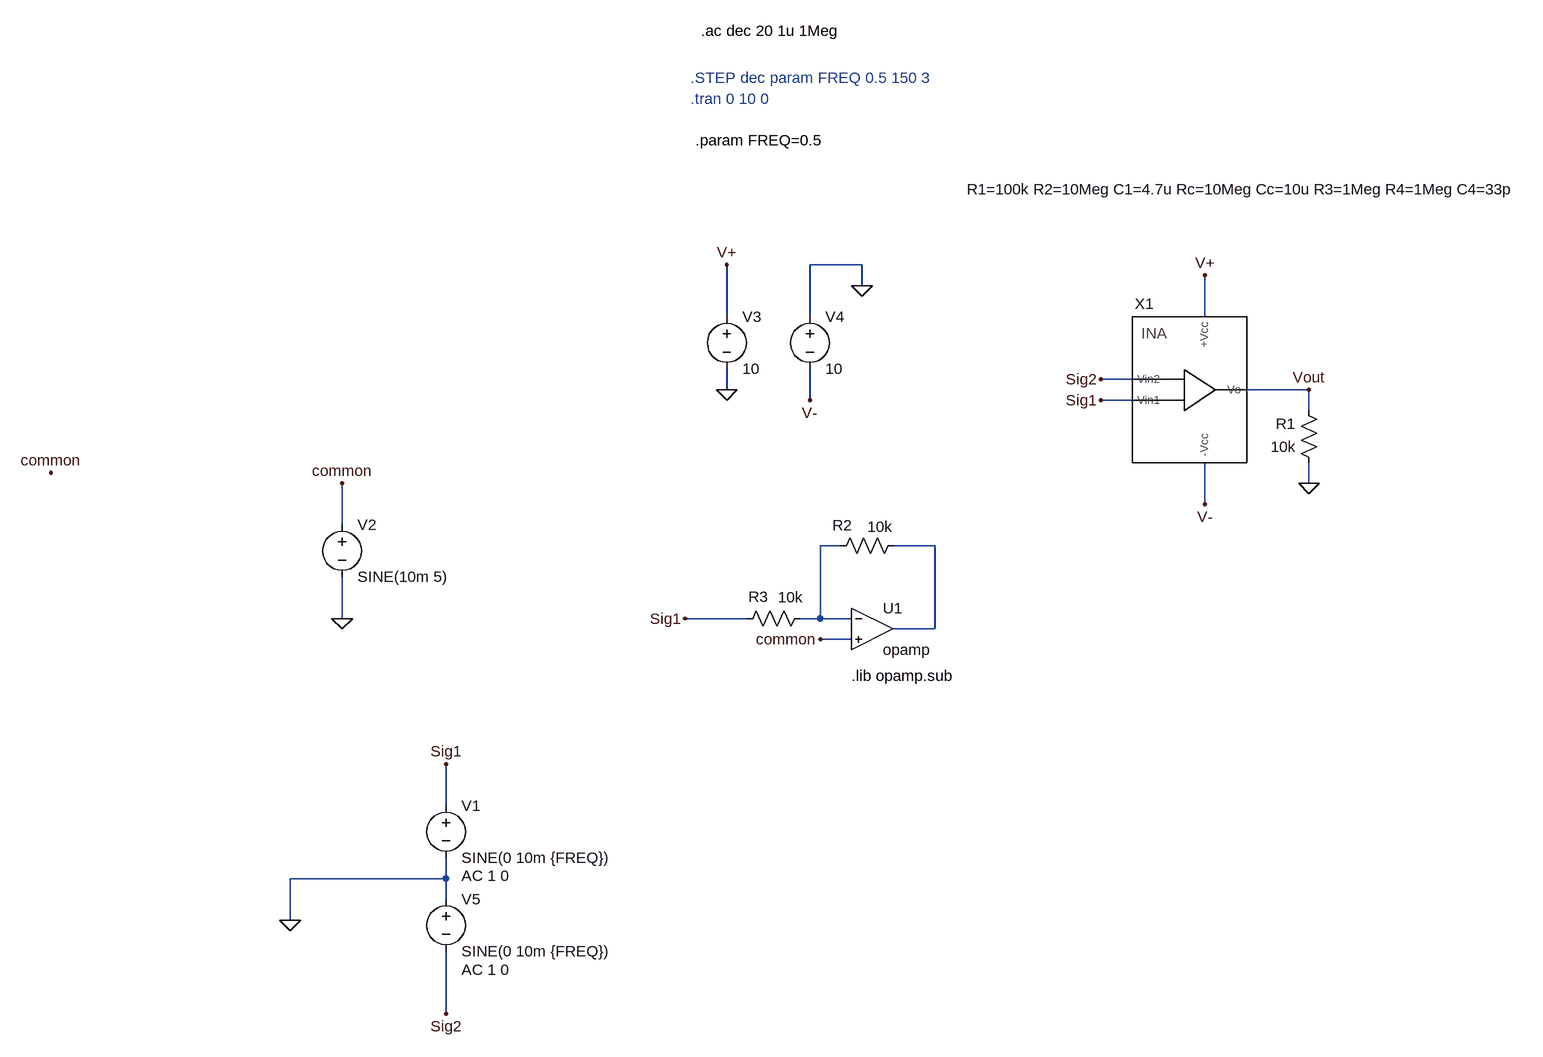
[diagram p0: schematic Test.asc]
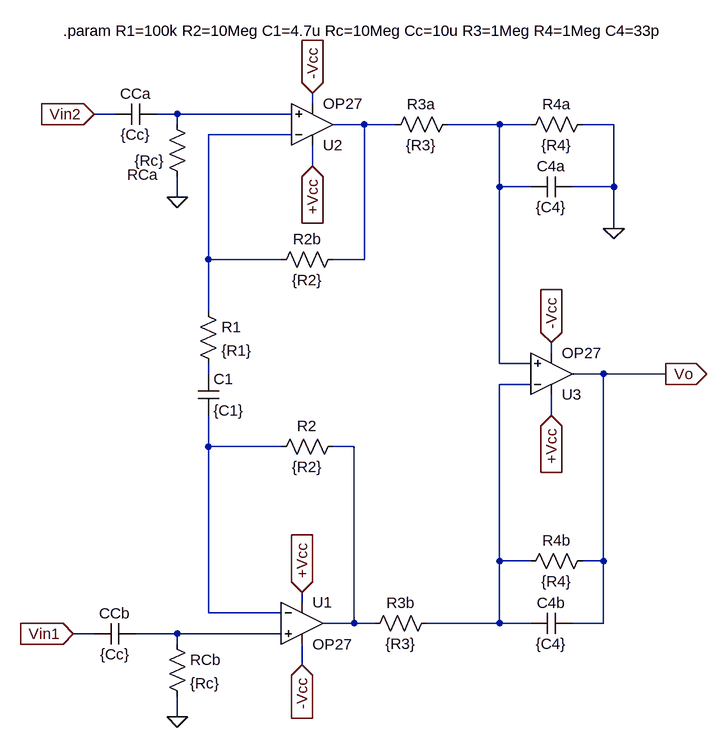
[diagram p1: sub-circuit instrument.asc]
Test.asc, the LTspice schematic file:
Version 4.1
SHEET 1 972 1232
WIRE -240 -16 -320 -16
WIRE -240 16 -240 -16
WIRE -448 64 -448 -16
WIRE -320 64 -320 -16
WIRE 288 64 288 0
WIRE 176 160 128 160
WIRE -448 176 -448 144
WIRE 448 176 352 176
WIRE -320 192 -320 144
WIRE 176 192 128 192
WIRE 448 208 448 176
WIRE 448 320 448 288
WIRE 288 352 288 288
WIRE -1040 384 -1040 320
WIRE -272 416 -304 416
WIRE -128 416 -192 416
WIRE -1040 528 -1040 464
WIRE -416 528 -512 528
WIRE -304 528 -304 416
WIRE -304 528 -336 528
WIRE -256 528 -304 528
WIRE -128 544 -128 416
WIRE -128 544 -192 544
WIRE -256 560 -304 560
WIRE -880 816 -880 752
WIRE -880 928 -880 896
WIRE -880 928 -1120 928
WIRE -880 960 -880 928
WIRE -1120 992 -1120 928
WIRE -880 1136 -880 1040
FLAG -880 1136 Sig2
FLAG -304 560 common
FLAG -512 528 Sig1
FLAG 128 192 Sig1
FLAG 128 160 Sig2
FLAG -1040 528 0
FLAG -1040 320 common
FLAG -1488 304 common
FLAG -880 752 Sig1
FLAG 448 320 0
FLAG 448 176 Vout
FLAG 288 352 V-
FLAG 288 0 V+
FLAG -1120 992 0
FLAG -240 16 0
FLAG -448 176 0
FLAG -448 -16 V+
FLAG -320 192 V-
SYMBOL Instrument 288 176 R0
WINDOW 39 61 -293 Bottom 2
SYMATTR SpiceLine R1=100k R2=10Meg C1=4.7u Rc=10Meg Cc=10u R3=1Meg R4=1Meg C4=33p
SYMATTR InstName X1
SYMBOL lib\\lib\\sym\\opamp -224 480 R0
SYMATTR InstName U1
SYMBOL res -176 400 R90
WINDOW 0 0 94 VBottom 2
WINDOW 3 -29 36 VTop 2
SYMATTR InstName R2
SYMATTR Value 10k
SYMBOL res -320 512 R90
WINDOW 0 -2 79 VBottom 2
WINDOW 3 -32 30 VTop 2
SYMATTR InstName R3
SYMATTR Value 10k
SYMBOL voltage -880 800 R0
WINDOW 123 24 124 Left 2
WINDOW 39 0 0 Left 0
SYMATTR Value2 AC 1 0
SYMATTR InstName V1
SYMATTR Value SINE(0 10m {FREQ})
SYMBOL voltage -1040 368 R0
WINDOW 123 0 0 Left 0
WINDOW 39 0 0 Left 0
SYMATTR InstName V2
SYMATTR Value SINE(10m 5)
SYMBOL res 464 304 R180
WINDOW 0 36 76 Left 2
WINDOW 3 36 40 Left 2
SYMATTR InstName R1
SYMATTR Value 10k
SYMBOL voltage -448 48 R0
WINDOW 123 0 0 Left 0
WINDOW 39 0 0 Left 0
SYMATTR InstName V3
SYMATTR Value 10
SYMBOL voltage -320 48 R0
WINDOW 123 0 0 Left 0
WINDOW 39 0 0 Left 0
SYMATTR InstName V4
SYMATTR Value 10
SYMBOL voltage -880 944 R0
WINDOW 123 24 124 Left 2
WINDOW 39 0 0 Left 0
SYMATTR Value2 AC 1 0
SYMATTR InstName V5
SYMATTR Value SINE(0 10m {FREQ})
TEXT -504 -272 Left 2 ;.tran 0 10 0
TEXT -488 -376 Left 2 !.ac dec 20 1u 1Meg
TEXT -256 616 Left 2 !.lib opamp.sub
TEXT -496 -208 Left 2 !.param FREQ=0.5
TEXT -504 -304 Left 2 ;.STEP dec param FREQ 0.5 150 3

instrument.asc, the sub-circuit schematic file:
Version 4.1
SHEET 1 1344 684
WIRE 256 -288 256 -304
WIRE -48 -272 -80 -272
WIRE 48 -272 16 -272
WIRE 224 -272 48 -272
WIRE 48 -256 48 -272
WIRE 336 -256 288 -256
WIRE 384 -256 336 -256
WIRE 544 -256 464 -256
WIRE 592 -256 544 -256
WIRE 720 -256 672 -256
WIRE 224 -240 96 -240
WIRE 256 -192 256 -224
WIRE 544 -160 544 -256
WIRE 592 -160 544 -160
WIRE 720 -160 720 -256
WIRE 720 -160 656 -160
WIRE 48 -144 48 -176
WIRE 720 -96 720 -160
WIRE 96 -48 96 -240
WIRE 208 -48 96 -48
WIRE 336 -48 336 -256
WIRE 336 -48 288 -48
WIRE 96 32 96 -48
WIRE 624 96 624 80
WIRE 544 112 544 -160
WIRE 592 112 544 112
WIRE 96 128 96 112
WIRE 704 128 656 128
WIRE 800 128 704 128
WIRE 592 144 544 144
WIRE 624 192 624 160
WIRE 96 240 96 192
WIRE 208 240 96 240
WIRE 320 240 288 240
WIRE 544 416 544 144
WIRE 592 416 544 416
WIRE 704 416 704 128
WIRE 704 416 672 416
WIRE 240 480 240 464
WIRE 96 496 96 240
WIRE 208 496 96 496
WIRE 320 512 320 240
WIRE 320 512 272 512
WIRE 352 512 320 512
WIRE 544 512 544 416
WIRE 544 512 432 512
WIRE 592 512 544 512
WIRE 704 512 704 416
WIRE 704 512 656 512
WIRE -80 528 -112 528
WIRE 48 528 -16 528
WIRE 208 528 48 528
WIRE 48 544 48 528
WIRE 240 576 240 544
WIRE 48 656 48 624
FLAG 48 -144 0
FLAG 48 656 0
FLAG 720 -96 0
FLAG -112 528 Vin1
IOPIN -112 528 In
FLAG -80 -272 Vin2
IOPIN -80 -272 In
FLAG 800 128 Vo
IOPIN 800 128 Out
FLAG 256 -304 -Vcc
IOPIN 256 -304 In
FLAG 240 576 -Vcc
IOPIN 240 576 In
FLAG 624 80 -Vcc
IOPIN 624 80 In
FLAG 256 -192 +Vcc
IOPIN 256 -192 In
FLAG 240 464 +Vcc
IOPIN 240 464 In
FLAG 624 192 +Vcc
IOPIN 624 192 In
SYMBOL lib\\lib\\sym\\ZZZ\\OpAmps\\OP27 256 -192 M180
SYMATTR InstName U2
SYMBOL lib\\lib\\sym\\ZZZ\\OpAmps\\OP27 240 448 R0
SYMATTR InstName U1
SYMBOL lib\\lib\\sym\\ZZZ\\OpAmps\\OP27 624 192 M180
SYMATTR InstName U3
SYMBOL res 80 16 R0
SYMATTR InstName R1
SYMATTR Value {R1}
SYMATTR SpiceLine tol=1
SYMBOL cap 80 128 R0
SYMATTR InstName C1
SYMATTR Value {C1}
SYMBOL res 304 224 R90
WINDOW 0 0 56 VBottom 2
WINDOW 3 32 56 VTop 2
SYMATTR InstName R2
SYMATTR Value {R2}
SYMBOL res 448 496 R90
WINDOW 0 0 56 VBottom 2
WINDOW 3 32 56 VTop 2
SYMATTR InstName R3b
SYMATTR Value {R3}
SYMATTR SpiceLine tol=1
SYMBOL res 480 -272 R90
WINDOW 0 0 56 VBottom 2
WINDOW 3 32 56 VTop 2
SYMATTR InstName R3a
SYMATTR Value {R3}
SYMATTR SpiceLine tol=1
SYMBOL res 304 -64 R90
WINDOW 0 0 56 VBottom 2
WINDOW 3 32 56 VTop 2
SYMATTR InstName R2b
SYMATTR Value {R2}
SYMATTR SpiceLine tol=1
SYMBOL res 64 -160 R180
WINDOW 0 45 19 Left 2
WINDOW 3 36 40 Left 2
SYMATTR InstName RCa
SYMATTR Value {Rc}
SYMBOL cap 16 -288 R90
WINDOW 0 0 32 VBottom 2
WINDOW 3 32 32 VTop 2
SYMATTR InstName CCa
SYMATTR Value {Cc}
SYMBOL cap -16 512 R90
WINDOW 0 0 32 VBottom 2
WINDOW 3 32 32 VTop 2
SYMATTR InstName CCb
SYMATTR Value {Cc}
SYMBOL res 32 528 R0
SYMATTR InstName RCb
SYMATTR Value {Rc}
SYMBOL res 688 400 R90
WINDOW 0 0 56 VBottom 2
WINDOW 3 32 56 VTop 2
SYMATTR InstName R4b
SYMATTR Value {R4}
SYMATTR SpiceLine tol=1
SYMBOL cap 656 496 R90
WINDOW 0 0 32 VBottom 2
WINDOW 3 32 32 VTop 2
SYMATTR InstName C4b
SYMATTR Value {C4}
SYMBOL res 688 -272 R90
WINDOW 0 0 56 VBottom 2
WINDOW 3 32 56 VTop 2
SYMATTR InstName R4a
SYMATTR Value {R4}
SYMATTR SpiceLine tol=1
SYMBOL cap 656 -176 R90
WINDOW 0 0 32 VBottom 2
WINDOW 3 32 32 VTop 2
SYMATTR InstName C4a
SYMATTR Value {C4}
TEXT -128 -400 Left 2 !.param R1=100k R2=10Meg C1=4.7u Rc=10Meg Cc=10u R3=1Meg R4=1Meg C4=33p

The netlist it stands for:
* Test.asc
X§X1 V+ V- Sig1 Sig2 Vout instrument params: R1=100k R2=10Meg C1=4.7u Rc=10Meg Cc=10u R3=1Meg R4=1Meg C4=33p
X§U1 N001 common N002 opamp Aol=100K GBW=10Meg  ; pins invin noninvin out
R2 N002 N001 10k
R3 N001 Sig1 10k
V1 Sig1 0 SINE(0 10m {FREQ}) AC 1 0
V2 common 0 SINE(10m 5)
R1 0 Vout 10k
V3 V+ 0 10
V4 0 V- 10
V5 0 Sig2 SINE(0 10m {FREQ}) AC 1 0

* block symbol definitions
.subckt instrument +Vcc -Vcc Vin1 Vin2 Vo
X§U2 N001 N004 +Vcc -Vcc N002 OP27  ; pins In+ In- V+ V- OUT
X§U1 N009 N007 +Vcc -Vcc N008 OP27  ; pins In+ In- V+ V- OUT
X§U3 N003 N006 +Vcc -Vcc Vo OP27  ; pins In+ In- V+ V- OUT
R1 N004 N005 {R1} tol=1
C1 N005 N007 {C1}
R2 N008 N007 {R2}
R3b N006 N008 {R3} tol=1
R3a N003 N002 {R3} tol=1
R2b N002 N004 {R2} tol=1
RCa 0 N001 {Rc}
CCa N001 Vin2 {Cc}
CCb N009 Vin1 {Cc}
RCb N009 0 {Rc}
R4b Vo N006 {R4} tol=1
C4b Vo N006 {C4}
R4a 0 N003 {R4} tol=1
C4a 0 N003 {C4}
.param R1=100k R2=10Meg C1=4.7u Rc=10Meg Cc=10u R3=1Meg R4=1Meg C4=33p
.ends instrument

* .tran 0 10 0
.ac dec 20 1u 1Meg
.lib opamp.sub
.param FREQ=0.5
* .STEP dec param FREQ 0.5 150 3
.lib ADI.lib
.backanno
.end